# Altium schematic sheet USB.SchDoc
size A3
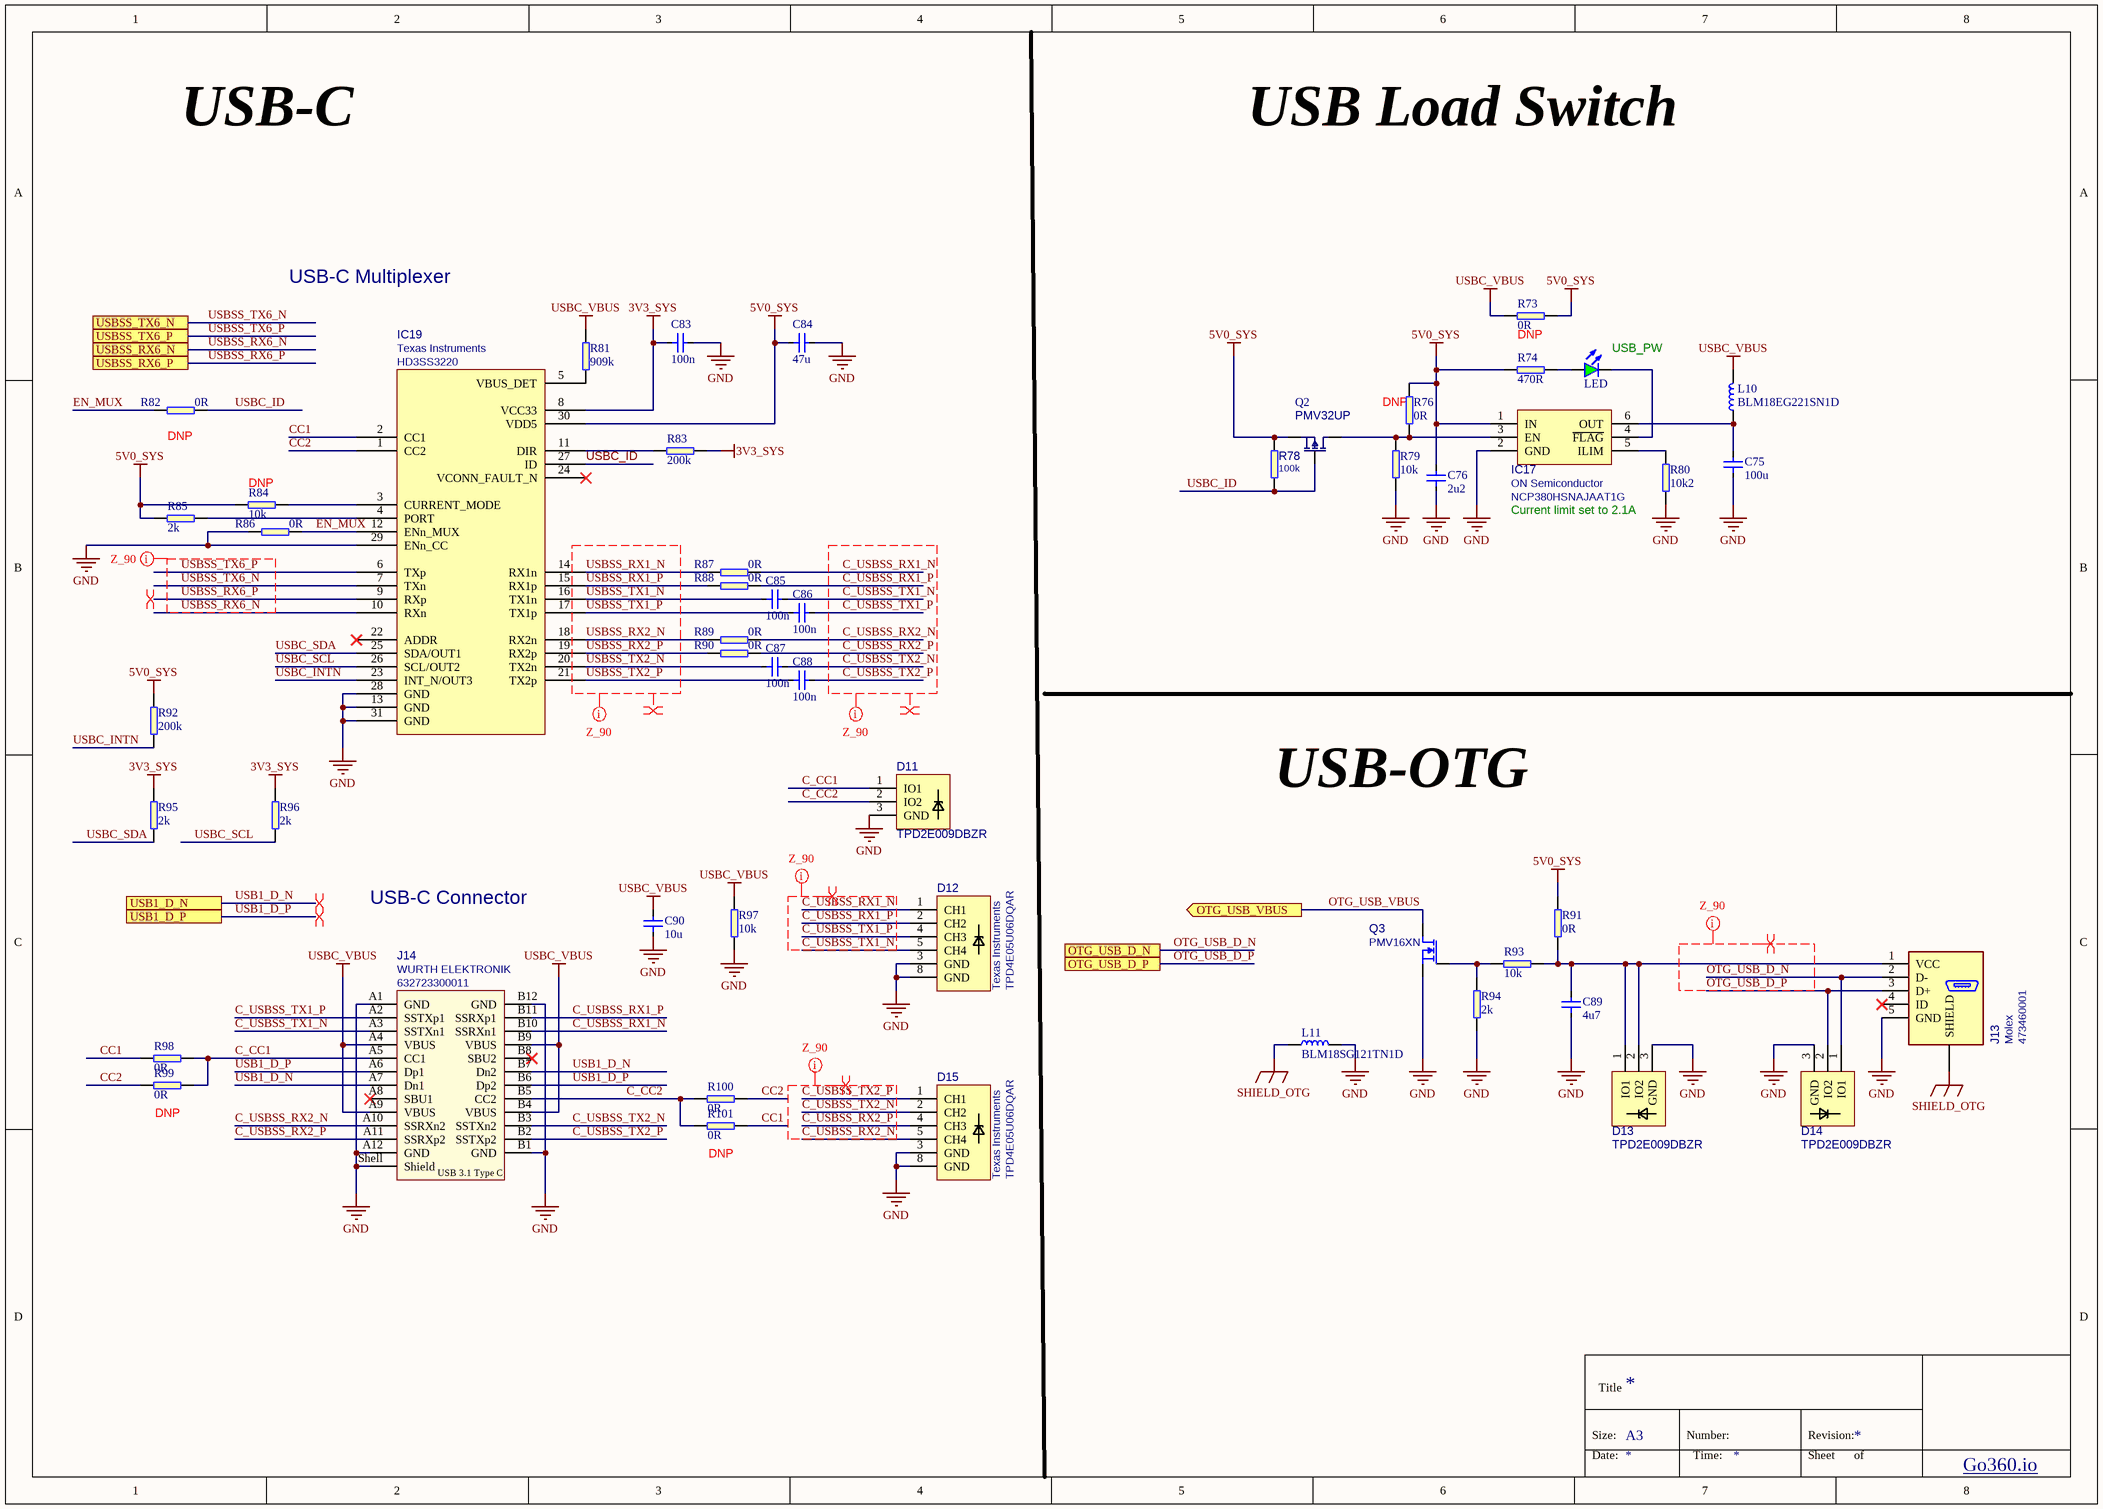
[diagram p0: USB.SchDoc]

## Parts
C75  100u  [1206]
C76  2u2  [C0402]
C83  100n  [C0402]
C84  47u  [0805]
C85  100n  [C0402]
C86  100n  [C0402]
C87  100n  [C0402]
C88  100n  [C0402]
C89  4u7  [C0402]
C90  10u  [C0603]
D11  TPD2E009DBZR  [SOT-23]
D12  Manufacturer: Texas Instruments  PartSymbol: TPD4E05U06DQAR  [TPD4E05U06_PASS]  (hidden comment: TPD4E05U06)
D13  TPD2E009DBZR  [SOT-23s]
D14  TPD2E009DBZR  [SOT-23s]
D15  Manufacturer: Texas Instruments  PartSymbol: TPD4E05U06DQAR  [TPD4E05U06_PASS]  (hidden comment: TPD4E05U06)
IC17  NCP380HSNAJAAT1G  Manufacturer: ON Semiconductor  [TSOP-6]
IC19  HD3SS3220  Manufacturer: Texas Instruments  [RNH0030A]
J13  Manufacturer: Molex  PartSymbol: 473460001  [CON-Molex-047346-0001]  (hidden comment: Molex 47346-0001)
J14  632723300011  Manufacturer: WURTH ELEKTRONIK  [WE_632723300011]
L10  BLM18EG221SN1D  [BEADC1608X65N]
L11  BLM18SG121TN1D  [BEADC1608X65N]
LED  SML-310MTT86  [LED0603]  (value not drawn)
Q2  PMV32UP  [SOT-23s]
Q3  PMV16XN  [SOT-23s]
R73  0R  [R0402]
R74  470R  [R0402]
R76  0R  [R0402]
R78  100k  [R0402]
R79  10k  [R0402]
R80  10k2  [R0402]
R81  909k  [R0402]
R82  0R  [R0402]
R83  200k  [R0402]
R84  10k  [R0402]
R85  2k  [R0402]
R86  0R  [R0402]
R87  0R  [R0402]
R88  0R  [R0402]
R89  0R  [R0402]
R90  0R  [R0402]
R91  0R  [R0402]
R92  200k  [R0402]
R93  10k  [R0402]
R94  2k  [R0402]
R95  2k  [R0402]
R96  2k  [R0402]
R97  10k  [R0402]
R98  0R  [R0402]
R99  0R  [R0402]
R100  0R  [R0402]
R101  0R  [R0402]

## Ports
OTG_USB_D_N, OTG_USB_D_P, OTG_USB_VBUS (out), USB1_D_N, USB1_D_P, USBSS_RX6_N, USBSS_RX6_P, USBSS_TX6_N, USBSS_TX6_P

## Nets
3V3_SYS: C83.1 IC19.8(VCC33) R83.2 R95.2 R96.2
5V0_SYS: C76.2 C84.1 IC17.1(IN) IC19.30(VDD5) Q2.2(S) R73.1 R74.1 R76.2 R78.1 R84.1 R85.1 R91.2 R92.2
GND: C75.1 C76.1 C83.2 C84.2 C89.1 C90.1 D11.3(GND) D12.3(GND) D12.8(GND) D13.3(GND) D14.3(GND) D15.3(GND) D15.8(GND) IC17.2(GND) IC19.13(GND) IC19.28(GND) IC19.29(ENn_CC) IC19.31(GND) J13.5(GND) J14.A1(GND) J14.A12(GND) J14.B1(GND) J14.B12(GND) J14.Shell(Shield) L11.2 Q3.2(S) R79.1 R80.1 R86.2 R94.1 R97.1
SHIELD_OTG: J13.S(SHIELD) L11.1
USBC_VBUS: C90.2 J14.A4(VBUS) J14.A9(VBUS) J14.B4(VBUS) J14.B9(VBUS) L10.2 R73.2 R81.2 R97.2
C_CC1: D11.1(IO1) J14.A5(CC1) R98.2 R99.2
C_CC2: D11.2(IO2) J14.B5(CC2) R100.1 R101.1
C_USBSS_RX1_N: D12.1(CH1) J14.B10(SSRXn1) R87.1
C_USBSS_RX1_P: D12.2(CH2) J14.B11(SSRXp1) R88.1
C_USBSS_RX2_N: D15.5(CH4) J14.A10(SSRXn2) R89.1
C_USBSS_RX2_P: D15.4(CH3) J14.A11(SSRXp2) R90.1
C_USBSS_TX1_N: C85.2 D12.5(CH4) J14.A3(SSTXn1)
C_USBSS_TX1_P: C86.2 D12.4(CH3) J14.A2(SSTXp1)
C_USBSS_TX2_N: C87.2 D15.2(CH2) J14.B3(SSTXn2)
C_USBSS_TX2_P: C88.2 D15.1(CH1) J14.B2(SSTXp2)
CC1: IC19.2(CC1) R98.1 R101.2
CC2: IC19.1(CC2) R99.1 R100.2
EN_MUX: IC19.12(ENn_MUX) R82.2 R86.1
OTG_USB_D_N: D14.1(IO1) J13.2(D-) ; port OTG_USB_D_N
OTG_USB_D_P: D14.2(IO2) J13.3(D+) ; port OTG_USB_D_P
OTG_USB_VBUS: Q3.3(D) ; port OTG_USB_VBUS
USB1_D_N: J14.A7(Dn1) J14.B7(Dn2) ; port USB1_D_N
USB1_D_P: J14.A6(Dp1) J14.B6(Dp2) ; port USB1_D_P
USBC_ID: IC19.27(ID) Q2.1(G) R78.2 R82.1
USBC_INTN: IC19.23(INT_N/OUT3) R92.1
USBC_SCL: IC19.26(SCL/OUT2) R96.1
USBC_SDA: IC19.25(SDA/OUT1) R95.1
USBSS_RX1_N: IC19.14(RX1n) R87.2
USBSS_RX1_P: IC19.15(RX1p) R88.2
USBSS_RX2_N: IC19.18(RX2n) R89.2
USBSS_RX2_P: IC19.19(RX2p) R90.2
USBSS_RX6_N: IC19.10(RXn) ; port USBSS_RX6_N
USBSS_RX6_P: IC19.9(RXp) ; port USBSS_RX6_P
USBSS_TX1_N: C85.1 IC19.16(TX1n)
USBSS_TX1_P: C86.1 IC19.17(TX1p)
USBSS_TX2_N: C87.1 IC19.20(TX2n)
USBSS_TX2_P: C88.1 IC19.21(TX2p)
USBSS_TX6_N: IC19.7(TXn) ; port USBSS_TX6_N
USBSS_TX6_P: IC19.6(TXp) ; port USBSS_TX6_P
NetC75_2: C75.2 IC17.6(OUT) L10.1
NetC89_2: C89.2 D13.1(IO1) D13.2(IO2) J13.1(VCC) R91.1 R93.2
NetIC17_3: IC17.3(EN) Q2.3(D) R76.1 R79.2
NetIC17_4: IC17.4(~{FLAG}) LED.K
NetIC17_5: IC17.5(ILIM) R80.2
NetIC19_3: IC19.3(CURRENT_MODE) R84.2
NetIC19_4: IC19.4(PORT) R85.2
NetIC19_5: IC19.5(VBUS_DET) R81.1
NetIC19_11: IC19.11(DIR) R83.1
NetLED_A: LED.A R74.2
NetQ3_1: Q3.1(G) R93.1 R94.2

Not connected (* = marked no-connect by the designer): IC19 22(ADDR)* 24(VCONN_FAULT_N)*; J13 4(ID)*; J14 A8(SBU1)* B8(SBU2)*

## Layout directives
differential pair: C_USBSS_RX1_N, C_USBSS_RX1_P, C_USBSS_RX2_N, C_USBSS_RX2_P, C_USBSS_TX1_N, C_USBSS_TX1_P, C_USBSS_TX2_N, C_USBSS_TX2_P, OTG_USB_D_N, OTG_USB_D_P, USB1_D_N, USB1_D_P, USBSS_RX1_N, USBSS_RX1_P, USBSS_RX2_N, USBSS_RX2_P, USBSS_RX6_P, USBSS_TX1_N, USBSS_TX1_P, USBSS_TX2_N, USBSS_TX2_P
net class Z_90: C_USBSS_RX1_N, C_USBSS_RX1_P, C_USBSS_RX2_N, C_USBSS_RX2_P, C_USBSS_TX1_N, C_USBSS_TX1_P, C_USBSS_TX2_N, C_USBSS_TX2_P, OTG_USB_D_N, OTG_USB_D_P, USBSS_RX1_N, USBSS_RX1_P, USBSS_RX2_N, USBSS_RX2_P, USBSS_RX6_N, USBSS_RX6_P, USBSS_TX1_N, USBSS_TX1_P, USBSS_TX2_N, USBSS_TX2_P, USBSS_TX6_N, USBSS_TX6_P

## Notes on the sheet
- USB-C
- USB Load Switch
- USB-C Multiplexer
- (near R73) DNP
- (near LED) USB_PW
- (near R82) DNP
- (near R76) DNP
- (near R84) DNP
- (near R80) Current limit set to 2.1A
- USB-OTG
- USB-C Connector
- (near R99) DNP
- (near R101) DNP
- Title
- Size:
- Date:
- A3
- Number:
- Time:
- Revision:
- Sheet
- of
- Go360.io
- (in symbol WE_632723300011) USB 3.1 Type C

## Library data of the parts
C75 = C_100u_1206: MLCC SMT Capacitor 100uF 1206; Manufacturer: Taiyo Yuden; PartSymbol: JMK316BJ107ML-T; PartNumber: C_100u_1206; Value: 100u
C76 = C_2u2_0402: MLCC SMT Capacitor 2.2uF 0402; Manufacturer: TDK; PartSymbol: C1005X5R1A225K050BC; PartNumber: C_2u2_0402; Value: 2u2
C83 C85-C88 = C_100n_0402: MLCC SMT Capacitor 100n 0402; Manufacturer: TDK; PartSymbol: C1005X5R0J104K050BA; PartNumber: C_100n_0402; Value: 100n
C84 = C_47u_0805: MLCC SMT Capacitor 47uF 0805; Manufacturer: KEMET; PartSymbol: C0805C476M9PACTU; PartNumber: C_47u_0805; Value: 47u
C89 = C_4u7_0402: MLCC SMT Capacitor 4.7uF 0402; Manufacturer: MURATA; PartSymbol: GRM155R60G475ME; PartNumber: C_4u7_0402; Value: 4u7
C90 = C_10u_0603: MLCC SMT Capacitor 10uF 0603; Manufacturer: Walsin; PartSymbol: 0603X106M6R3CT; PartNumber: C_10u_0603; Value: 10u
D11 D13 D14 = TPD2E009DBZR: DIODE, SCHOTTKY, 30V, 200MA, SOT-23; Manufacturer: NXP; PartNumber: TPD2E009DBZR; Value: TPD2E009DBZR; MPN: TPD2E009DBZR
D12 D15 = TPD4E05U06: ESD Suppressors 4-CH; PartNumber: TPD4E05U06_PASS; Value: TPD4E05U06
IC17 = NCP380HSNAJAAT1G: POWER LOAD SWITCH, HIGH SIDE; Value: NCP380HSNAJAAT1G; PartNumber: NCP380HSNAJAAT1G; PartSymbol: NCP380HSNAJAAT1G
IC19 = HD3SS3220: IC DRP PORT CTLR USB-C 30WQFN; PartSymbol: HD3SS3220RNHT; PartNumber: HD3SS3220; Value: HD3SS3220
J13 = Micro USB B: USB - micro B Receptacle Connector 5 Position Surface Mount, Right Angle, Horizontal; PartNumber: CON-Molex-47346-0001; Value: Molex 47346-0001
J14 = WE_632723300011: USB 3.1 Type C Receptacle Horizontal THR WR-COM; PartNumber: WE_632723300011; Value: 632723300011; PartSymbol: 632723300011
L10 = BLM18EG221SN1D: MURATA  BLM18EG221SN1D  FERRITE BEAD, 0.05OHM, 2A, 0603; PartNumber: BLM18EG221SN1D; Value: BLM18EG221SN1D; Manufacturer: MURATA; PartSymbol: BLM18EG221SN1D
L11 = BLM18SG121TN1D: FERRITE BEAD, 0.025OHM, 3A, 0603; Manufacturer: MURATA; PartNumber: BLM18SG121TN1D; Value: BLM18SG121TN1D; PartSymbol: BLM18SG121TN1D
LED = LED: LED Green 0603 case; Manufacturer: ROHM Semicon; PartNumber: LED_G; Value: SML-310MTT86; PartSymbol: SML-310MTT86
Q2 = PMOS: P CH, 20V, 4A; Manufacturer: NXP; PartNumber: PMV32UP; Value: PMV32UP; PartSymbol: PMV32UP
Q3 = NMOS_PMV16XN: MOSFET, N CH; Manufacturer: NXP; Value: PMV16XN; PartNumber: PMV16XN; PartSymbol: PMV16XN
R73 R76 R82 R86-R91 R98-R101 = R_0R_0402: RES, 0R, 0402; Manufacturer: Panasonic; PartSymbol: ERJ2GE0R00X; PartNumber: R_0R_0402; Value: 0R
R74 = R_470R_0402: RES, 470R, 0402; Manufacturer: VISHAY; PartSymbol: CRCW0402470RFKED.; PartNumber: R_470R_0402; Value: 470R
R78 = R_100k_0402: SMT Resistor 100k 0402; Manufacturer: VISHAY; PartSymbol: CRCW0402100KFKEDHP; Tolerance: 1%; PartNumber: R_100k_0402; Value: 100k
R79 R84 R93 R97 = R_10k_0402: RES, 10k, 0402; Manufacturer: MULTICOMP; PartSymbol: MCMR04X1002FTL; PartNumber: R_10k_0402; Value: 10k
R80 = R_10k2_0402: RES, 10k2, 0402, 0.1%; PartNumber: R_10k2_0402_0.1%; Manufacturer: TE CONECTIVITY; PartSymbol: CPF0402B10K2E1; Tolerance: 0.1%; Value: 10k2
R81 = R_909k_0402: RES, 909k, 0402; Manufacturer: Panasonic; PartSymbol: ERJ2RKF9093X; PartNumber: R_909k_0402; Value: 909k
R83 R92 = R_200k_0402: RES, 200k, 0402; Manufacturer: YAGEO; PartSymbol: RC0402FR-07200KL; PartNumber: R_200k_0402; Value: 200k
R85 R94-R96 = R_2k_0402: RES, 2k, 0402; Manufacturer: VISHAY; PartSymbol: CRCW04022K00FKED; PartNumber: R_2k_0402; Value: 2k